# EasyEDA schematic Teensy Tester.json
TITLE: Sheet_1; REV: 1.0; Date: 2022-02-03; Sheet: 1/1; Drawn By: philbobagins; Company: Your Company
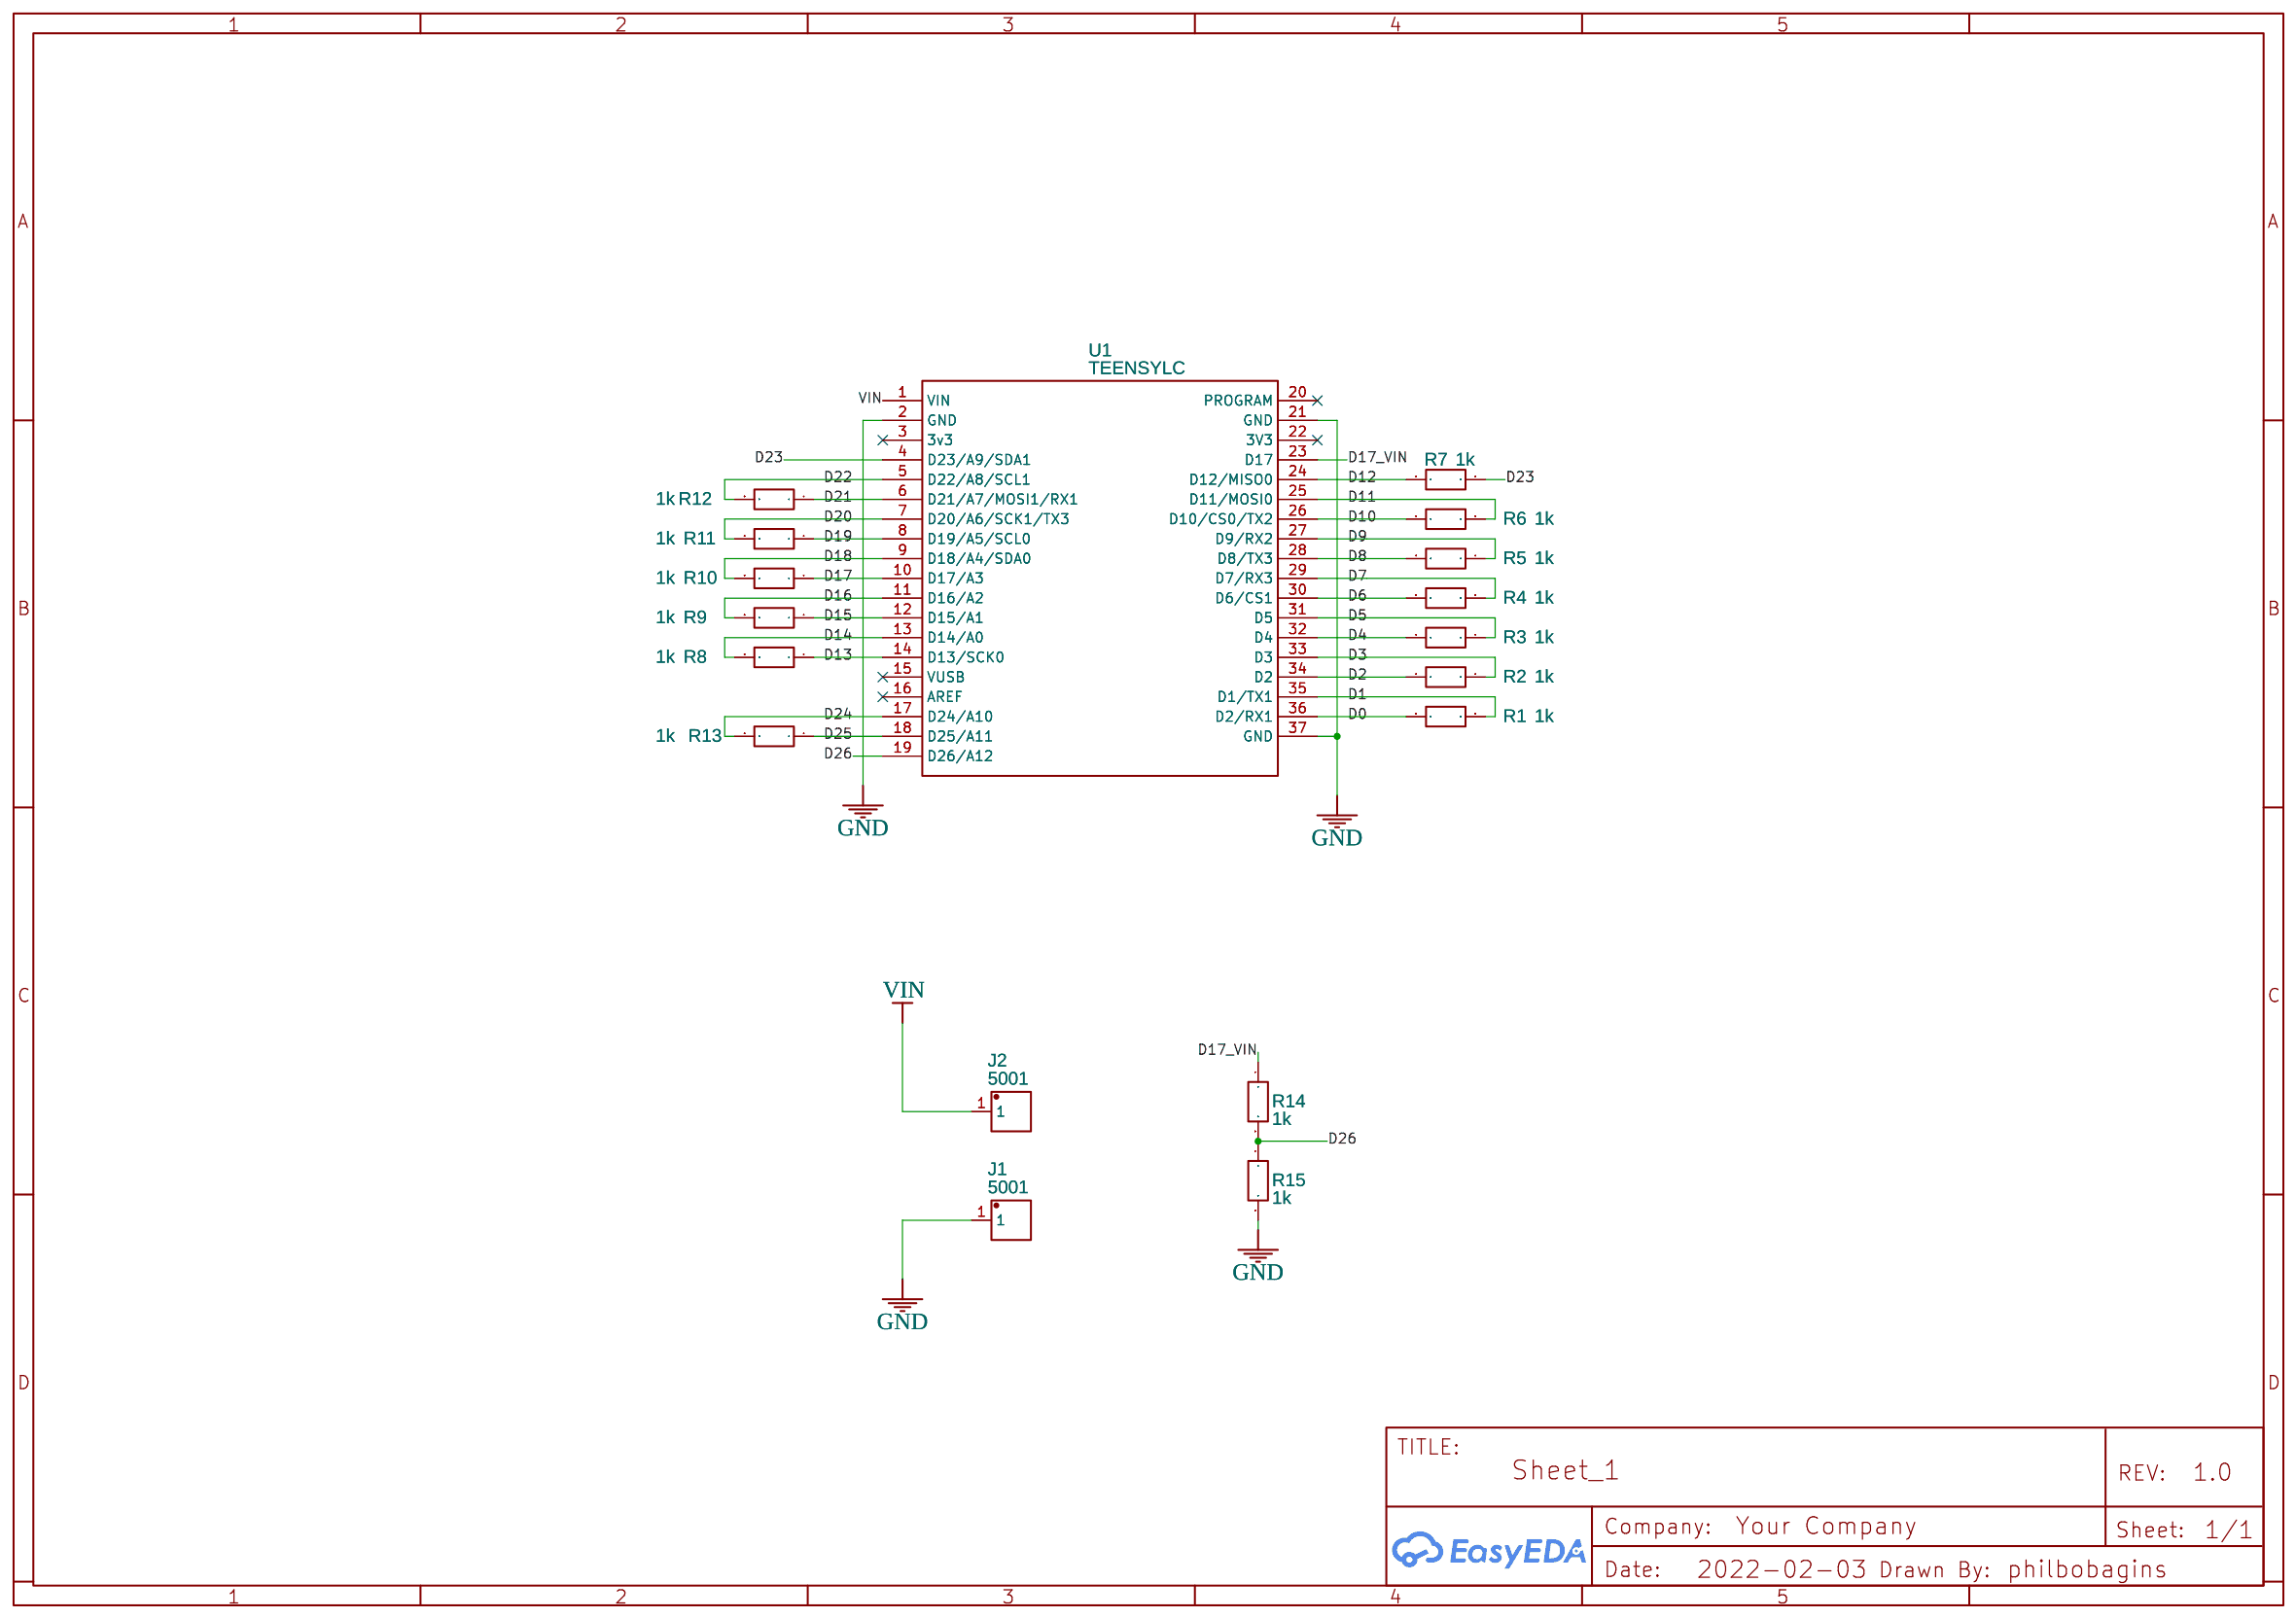
[diagram p0: schematic sheet]

## Parts
J1  5001  [TEST-TH_BD2.54-P1.39]
J2  5001  [TEST-TH_BD2.54-P1.39]
R1  1k  [R0603]
R2  1k  [R0603]
R3  1k  [R0603]
R4  1k  [R0603]
R5  1k  [R0603]
R6  1k  [R0603]
R7  1k  [R0603]
R8  1k  [R0603]
R9  1k  [R0603]
R10  1k  [R0603]
R11  1k  [R0603]
R12  1k  [R0603]
R13  1k  [R0603]
R14  1k  [R0603]
R15  1k  [R0603]
U1  TEENSYLC  [TEENSYLC]

## Library data of the parts
J1 J2 = 5001: Supplier: LCSC; Supplier Part: C238122; Manufacturer: Keystone; Contributor: LCSC; JLCPCB Part Class: Extended Part
R1-R15 = R_0603_EU: Contributor: LCEDA_Lib
U1 = TEENSYLC: Contributor: mhasnat0

## Nets
GND: J1.1 R15.2 U1.2(GND) U1.21(GND) U1.37(GND)
VIN: J2.1 U1.1(VIN)
D0: R1.2 U1.36(D2/RX1)
D1: R1.1 U1.35(D1/TX1)
D2: R2.2 U1.34(D2)
D3: R2.1 U1.33(D3)
D4: R3.2 U1.32(D4)
D5: R3.1 U1.31(D5)
D6: R4.2 U1.30(D6/CS1)
D7: R4.1 U1.29(D7/RX3)
D8: R5.2 U1.28(D8/TX3)
D9: R5.1 U1.27(D9/RX2)
D10: R6.2 U1.26(D10/CS0/TX2)
D11: R6.1 U1.25(D11/MOSI0)
D12: R7.2 U1.24(D12/MISO0)
D13: R8.1 U1.14(D13/SCK0)
D14: R8.2 U1.13(D14/A0)
D15: R9.1 U1.12(D15/A1)
D16: R9.2 U1.11(D16/A2)
D17: R10.1 U1.10(D17/A3)
D17_VIN: R14.1 U1.23(D17)
D18: R10.2 U1.9(D18/A4/SDA0)
D19: R11.1 U1.8(D19/A5/SCL0)
D20: R11.2 U1.7(D20/A6/SCK1/TX3)
D21: R12.1 U1.6(D21/A7/MOSI1/RX1)
D22: R12.2 U1.5(D22/A8/SCL1)
D23: R7.1 U1.4(D23/A9/SDA1)
D24: R13.2 U1.17(D24/A10)
D25: R13.1 U1.18(D25/A11)
D26: R14.2 R15.1 U1.19(D26/A12)

Not connected (* = marked no-connect by the designer): U1 3(3v3)* 15(VUSB)* 16(AREF)* 20(PROGRAM)* 22(3V3)*
